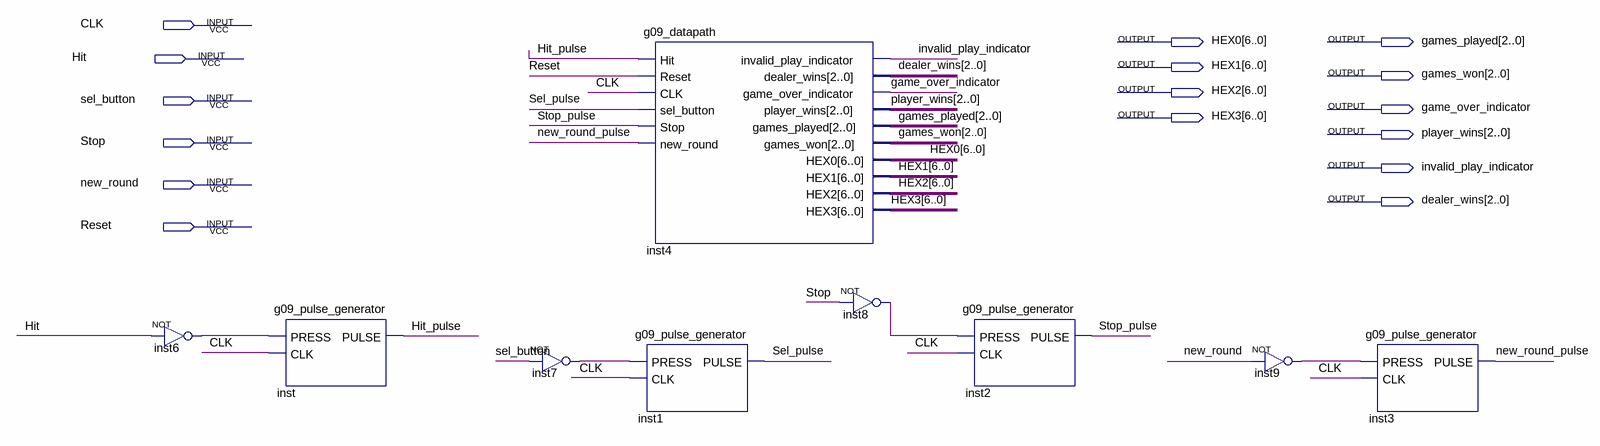
[diagram p0: schematic sheet]
// Quartus schematic g09_ALTERA_5.bdf as structural Verilog: 9 symbols, 16 pins
module g09_ALTERA_5 (
  input  CLK,
  input  Hit,
  input  sel_button,
  input  Stop,
  input  new_round,
  input  Reset,
  output [6:0] HEX0,
  output [2:0] games_played,
  output [6:0] HEX1,
  output [2:0] games_won,
  output [6:0] HEX2,
  output game_over_indicator,
  output [6:0] HEX3,
  output [2:0] player_wins,
  output invalid_play_indicator,
  output [2:0] dealer_wins
);

  wire Hit_pulse, inst6_out, inst7_out, inst8_out, inst9_out, new_round_pulse, Sel_pulse, Stop_pulse;

  not inst6 (inst6_out, Hit);
  g09_pulse_generator inst (.PRESS(inst6_out), .CLK(CLK), .PULSE(Hit_pulse));
  not inst7 (inst7_out, sel_button);
  g09_datapath inst4 (
    .Hit(Hit_pulse), .Reset(Reset), .CLK(CLK), .sel_button(Sel_pulse), .Stop(Stop_pulse),
    .new_round(new_round_pulse), .invalid_play_indicator(invalid_play_indicator), .dealer_wins(dealer_wins),
    .game_over_indicator(game_over_indicator), .player_wins(player_wins), .games_played(games_played),
    .games_won(games_won), .HEX0(HEX0), .HEX1(HEX1), .HEX2(HEX2), .HEX3(HEX3));
  g09_pulse_generator inst1 (.PRESS(inst7_out), .CLK(CLK), .PULSE(Sel_pulse));
  not inst8 (inst8_out, Stop);
  g09_pulse_generator inst2 (.PRESS(inst8_out), .CLK(CLK), .PULSE(Stop_pulse));
  not inst9 (inst9_out, new_round);
  g09_pulse_generator inst3 (.PRESS(inst9_out), .CLK(CLK), .PULSE(new_round_pulse));
endmodule
